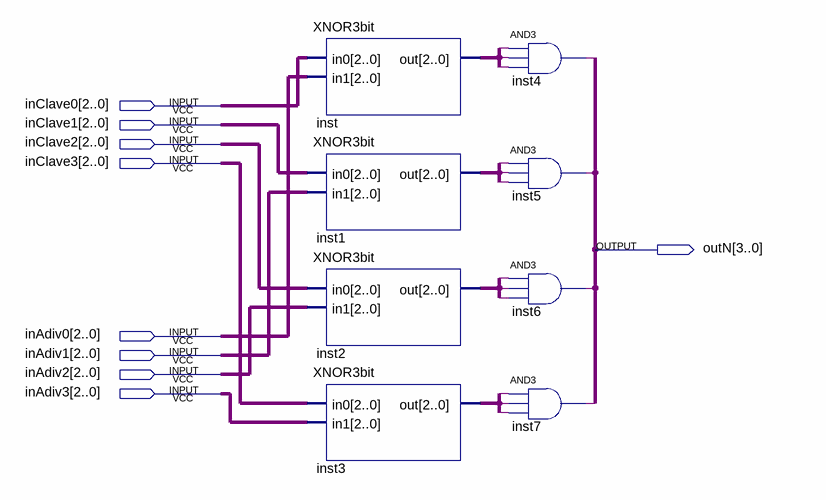
[diagram p0: schematic sheet]
// Quartus schematic COMPARA_N.bdf as structural Verilog: 8 symbols, 9 pins
module COMPARA_N (
  input  [2:0] inClave0,
  input  [2:0] inClave1,
  input  [2:0] inClave2,
  input  [2:0] inClave3,
  input  [2:0] inAdiv0,
  input  [2:0] inAdiv1,
  input  [2:0] inAdiv2,
  input  [2:0] inAdiv3,
  output [3:0] outN
);

  wire [2:0] out0, out1, out2, out3;

  XNOR3bit inst (.in0(inClave0), .in1(inAdiv0), .out(out0));
  XNOR3bit inst1 (.in0(inClave1), .in1(inAdiv1), .out(out1));
  XNOR3bit inst2 (.in0(inClave2), .in1(inAdiv2), .out(out2));
  XNOR3bit inst3 (.in0(inClave3), .in1(inAdiv3), .out(out3));
  and inst4 (outN[0], out0[0], out0[1], out0[2]);
  and inst5 (outN[1], out1[0], out1[1], out1[2]);
  and inst6 (outN[2], out2[0], out2[1], out2[2]);
  and inst7 (outN[3], out3[0], out3[1], out3[2]);
endmodule
